# EasyEDA schematic SCH_sentra_2026-03-12.json
TITLE: SENTRA; REV: 1.0; Date: 2026-02-24; Sheet: 1/1; Drawn By: -; Company: Teknik Mesin
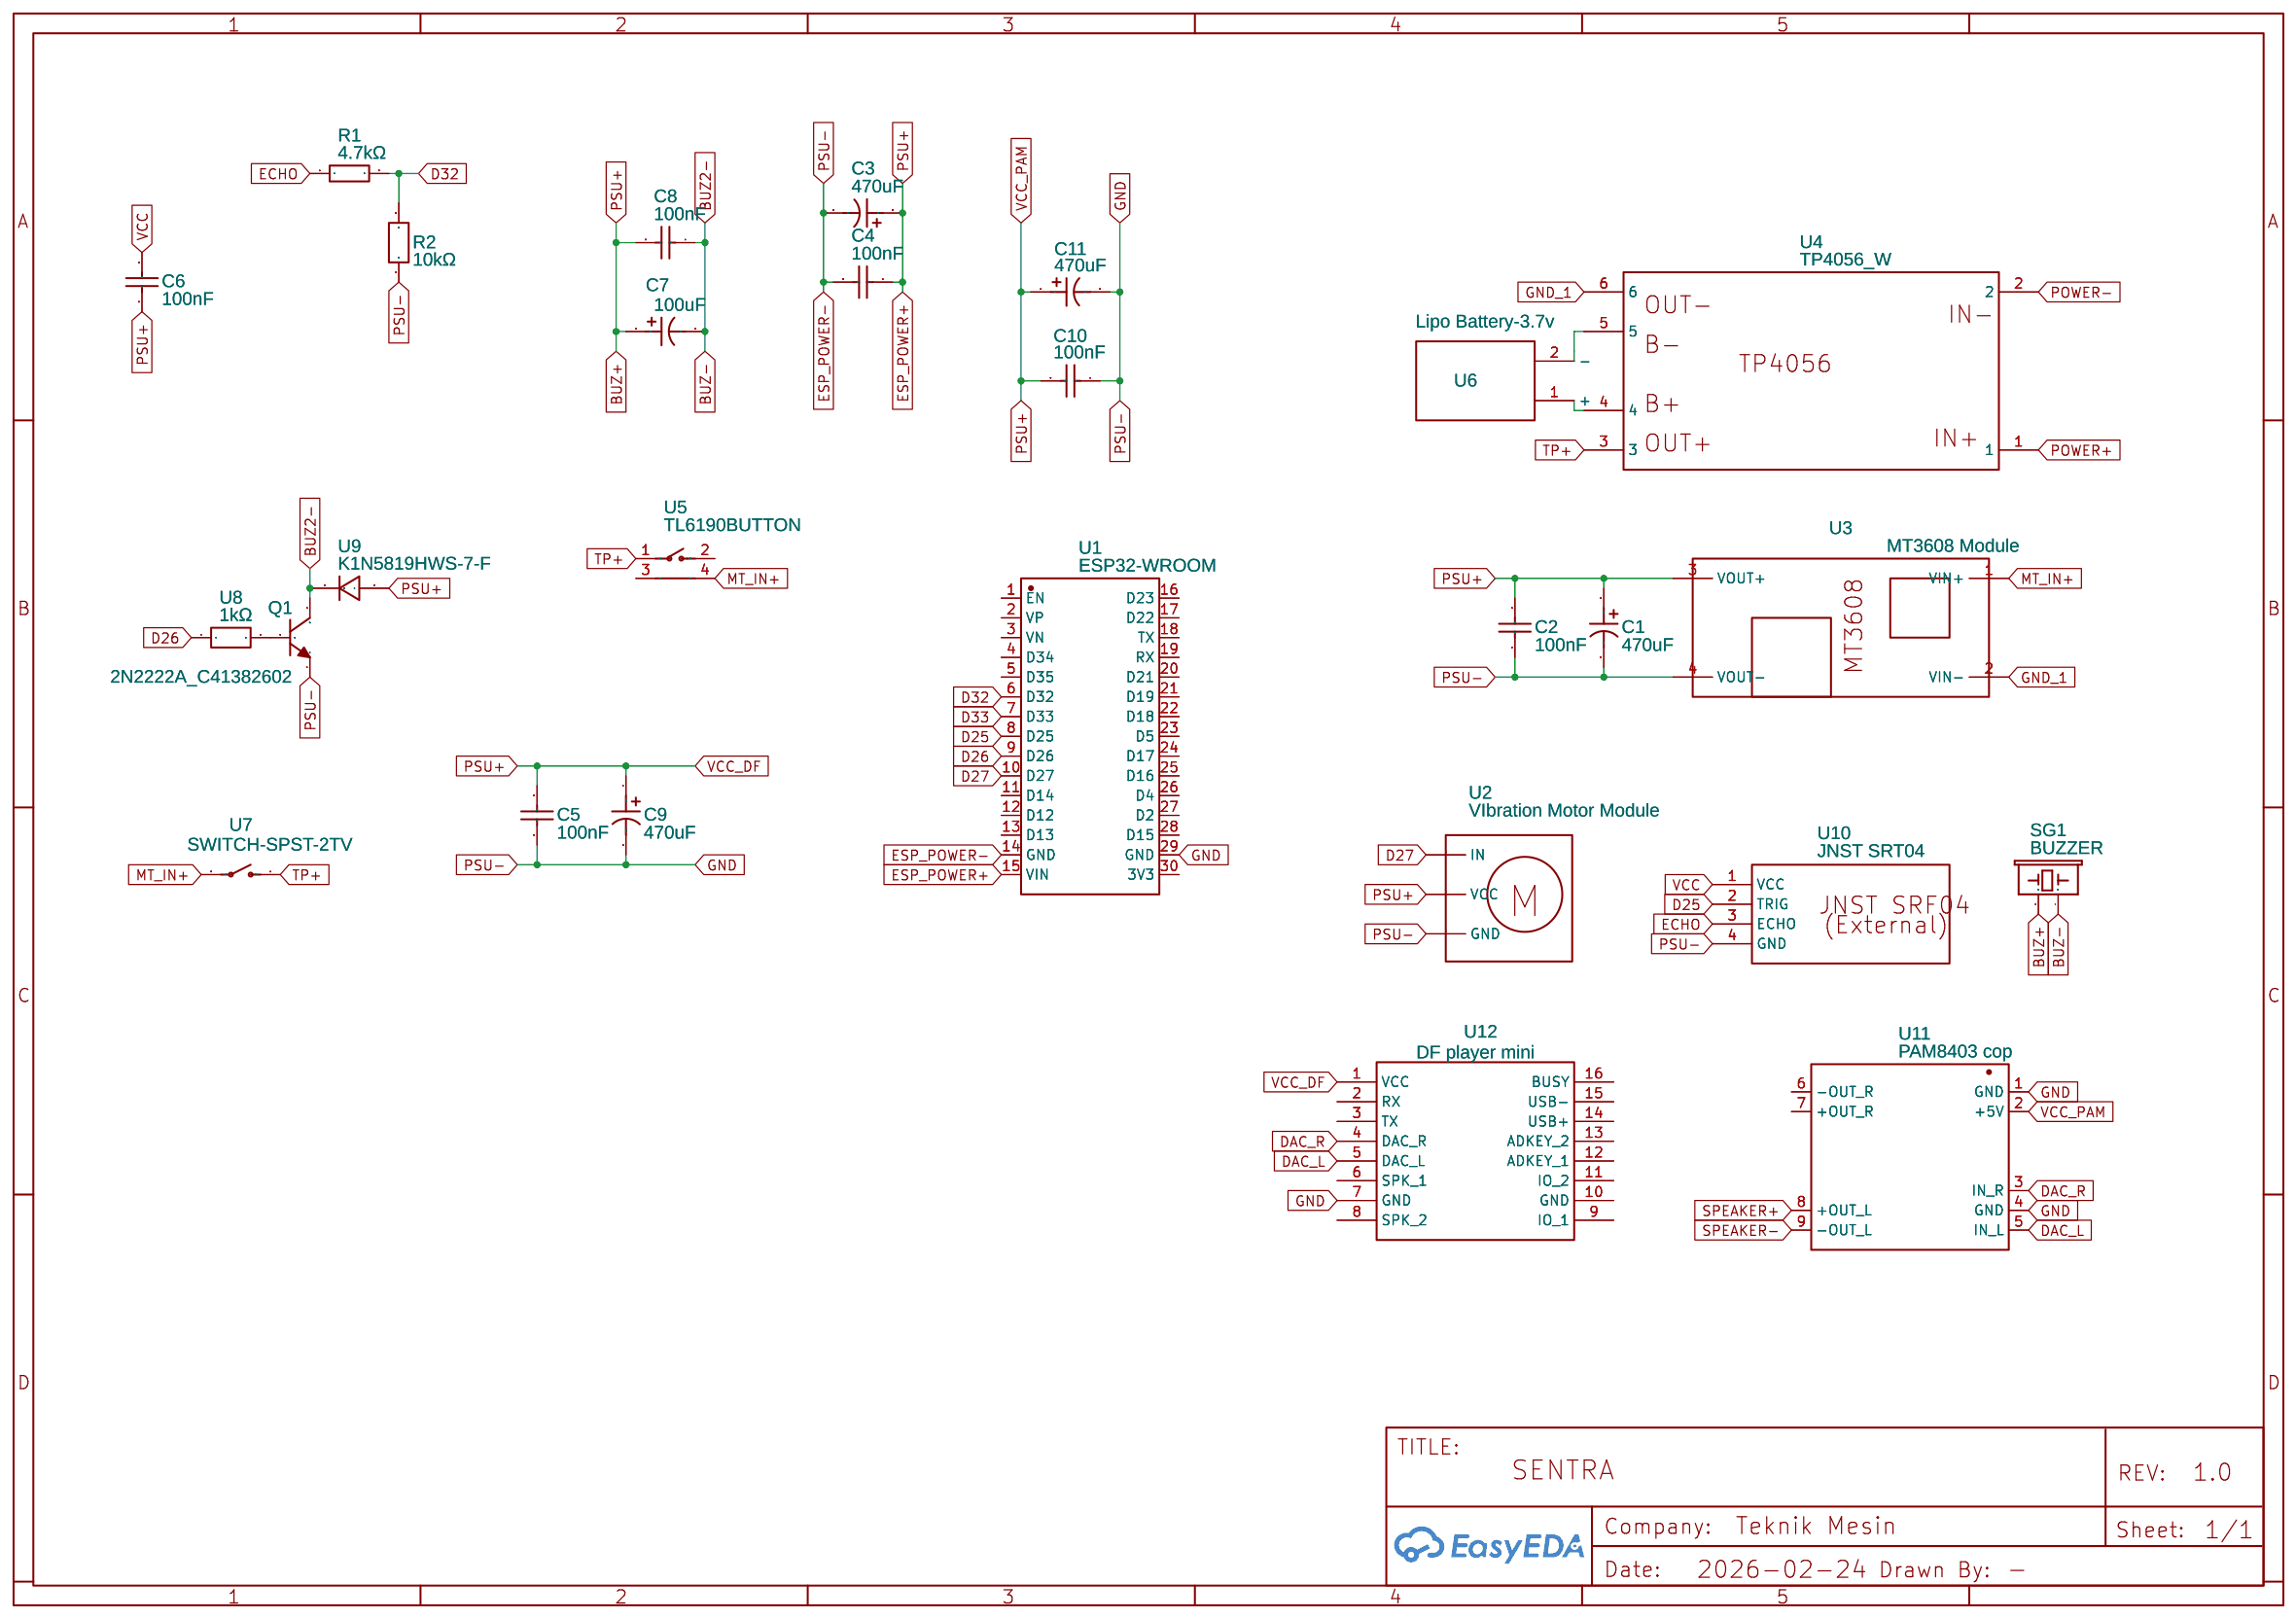
[diagram p0: schematic sheet]

## Parts
C1  470uF  [CAP-SMD_BD8.0-L8.3-W8.3-LS9.0-FD]
C2  100nF  [CAP-TH_L18.0-W10.0-P15.00-D0.8]
C3  470uF  [CAP-SMD_BD8.0-L8.3-W8.3-LS9.0-FD]
C4  100nF  [CAP-TH_L18.0-W10.0-P15.00-D0.8]
C5  100nF  [CAP-TH_L18.0-W10.0-P15.00-D0.8]
C6  100nF  [CAP-TH_L18.0-W10.0-P15.00-D0.8]
C7  100uF  [CAP-TH_BD18.0-P7.50-D1.2-FD]
C8  100nF  [CAP-TH_L18.0-W10.0-P15.00-D0.8]
C9  470uF  [CAP-SMD_BD8.0-L8.3-W8.3-LS9.0-FD]
C10  100nF  [CAP-TH_L18.0-W10.0-P15.00-D0.8]
C11  470uF  [CAP-SMD_BD8.0-L8.3-W8.3-LS9.0-FD]
Q1  2N2222A_C41382602  [TO-92-3_L4.9-W3.7-P1.27-L]
R1  4.7kΩ  [RES-TH_BD3.3-L9.0-P13.00-D0.6]
R2  10kΩ  [RES-TH_L11.0-W5.5-P15.00-D0.5]
SG1  BUZZER  [BUZZER-12MM-NS-KIT]
U1  ESP32-WROOM  [ESP32 WROOM-32 ESP32-S JOY-IT]
U2  VIbration Motor Module  [VIBRATION MOTOR MODULE]
U3  MT3608 Module  [MT3608]
U4  TP4056_W  [TP4056_W]
U5  TL6190BUTTON  [SW-TH_TL6190BUTTON]
U6  Lipo Battery-3.7v  [LIPO BATTERY-3.7V]
U7  SWITCH-SPST-2TV  [SWITCH-SPST-VERTICAL]
U8  1kΩ  [RES-TH_BD8.0-L22.0-P26.00-D0.8]
U9  K1N5819HWS-7-F  [SOD-323_L1.7-W1.3-LS2.6-RD-1]
U10  JNST SRT04  [HY_SRF05]
U11  PAM8403 cop  [PAM8403]
U12  DF player mini  [DFPLAYER MINI MP3 PLAYER MODULE]

## Library data of the parts
C1 C3 C9 C11 = RYHV25V470UF8*10: Supplier: LCSC; Supplier Part: C48970614; Manufacturer: HONOR(荣誉); JLCPCB Part Class: Extended Part; Contributor: lcsc
C2 C4-C6 C8 C10 = MPP104J6190712LC: Supplier: LCSC; Manufacturer: SRD(圣融达); Manufacturer Part: MPP104J2J1907128LC; Supplier Part: C109513; JLCPCB Part Class: Extended Part
C7 = SHC450V100UF01EC3238: Supplier: LCSC; Supplier Part: C5263886; Manufacturer: KNSCHA(科尼盛); JLCPCB Part Class: Extended Part; Contributor: lcsc
Q1 = 2N2222A_C41382602: Supplier: LCSC; Supplier Part: C41382602; Manufacturer: YFW(佑风微); Manufacturer Part: 2N2222A; JLCPCB Part Class: Extended Part; Contributor: lcsc
R1 = MF1/2W-4.7KΩ±1% T52: Contributor: LCSC; Supplier: LCSC; Supplier Part: C119429; Manufacturer: CCO(千志电子); Manufacturer Part: MF1/2W-4.7KΩ±1% T; JLCPCB Part Class: Extended Part
R2 = TFSB10K0JE: Contributor: lcsc; Supplier: LCSC; Supplier Part: C3496006; Manufacturer: Ohmite; JLCPCB Part Class: Extended Part
SG1 = BUZZER: Contributor: SparkFun
U1 = ESP32-WROOM: Supplier Part: C571181; Manufacturer: ESPRESSIF(乐鑫); Manufacturer Part: ESP32 WROOM-32 ESP32-S; JLCPCB Part Class: Extended Part; Contributor: maciekhka
U2 = VIbration Motor Module: Contributor: thomasdrive04
U3 = MT3608 Module: Supplier: Aliexpress; Contributor: Athantos
U4 = TP4056_W: Contributor: igor040885
U5 = TL6190BUTTON: Supplier: LCSC; Supplier Part: C20573146; Manufacturer: E-Switch; Contributor: lcsc
U6 = Lipo Battery-3.7v: Contributor: noeltoms
U7 = SWITCH-SPST-2TV: Contributor: SparkFun
U8 = SQP300JB-1K: Contributor: lcsc; Supplier: LCSC; Supplier Part: C1392846; Manufacturer: YAGEO(国巨); JLCPCB Part Class: Extended Part
U9 = K1N5819HWS-7-F: Supplier: LCSC; Supplier Part: C2891705; Manufacturer: KUU; JLCPCB Part Class: Extended Part; Contributor: lcsc
U10 = HY-SRF05: Contributor: ihsannurhakim
U11 = PAM8403 cop: Supplier Part: C17337; Supplier: LCSC; Manufacturer: DIODES; Manufacturer Part: PAM8403DR; Contributor: Destora
U12 = DF player mini: Contributor: Circuit Master; sourceId: cKDVP7pjB

## Nets
GND_1: U3.2(VIN-) U4.6
VCC: C6.1 U10.1(VCC)
BUZ+: C1.1 C2.2 C3.1 C4.1 C5.2 C6.2 C7.1 C8.2 C9.1 C10.2 C11.1 SG1.+(1) U1.15(VIN) U2.2(VCC) U3.3(VOUT+) U9.2(A) U11.2(+5V) U12.1(VCC)
BUZ-: C7.2 C8.1 Q1.3(C) SG1.-(2) U9.1(C)
D25: U1.8(D25) U10.2(TRIG)
D26: U1.9(D26) U8.1
D27: U1.10(D27) U2.1(IN)
D32: R1.2 R2.2 U1.6(D32)
D33: U1.7(D33)
DAC_L: U11.5(IN L) U12.5(DAC_L)
DAC_R: U11.3(IN R) U12.4(DAC_R)
ECHO: R1.1 U10.3(ECHO)
ESP_POWER-: C1.2 C2.1 C3.2 C4.2 C5.1 C9.2 C10.1 C11.2 Q1.1(E) R2.1 U1.14(GND) U1.29(GND) U2.3(GND) U3.4(VOUT-) U10.4(GND) U11.1(GND) U11.4(GND) U12.7(GND)
MT_IN+: U3.1(VIN+) U5.4 U7.2(P)
POWER+: U4.1
POWER-: U4.2
SPEAKER+: U11.8(+OUT_L)
SPEAKER-: U11.9(-OUT_L)
TP+: U4.3 U5.1 U7.1(O)
Net-(Q1-2): Q1.2(B) U8.2

Not connected (* = marked no-connect by the designer): U1 1(EN) 2(VP) 3(VN) 4(D34) 5(D35) 11(D14) 12(D12) 13(D13) 16(D23) 17(D22) 18(TX) 19(RX) 20(D21) 21(D19) 22(D18) 23(D5) 24(D17) 25(D16) 26(D4) 27(D2) 28(D15) 30(3V3); U4 4 5; U5 2 3; U6 1(+) 2(-); U11 6(-OUT_R) 7(+OUT_R); U12 2(RX) 3(TX) 6(SPK_1) 8(SPK_2) 9(IO_1) 10(GND) 11(IO_2) 12(ADKEY_1) 13(ADKEY_2) 14(USB+) 15(USB-) 16(BUSY)
